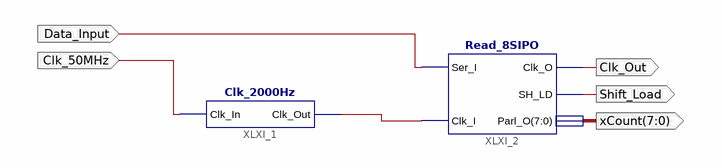
[diagram p0: schematic sheet 1]
// Xilinx ISE schematic FFG.sch (spartan6) as structural Verilog: 2 symbols, 5 ports
module FFG (
  input  Data_Input,
  input  Clk_50MHz,
  output Clk_Out,
  output Shift_Load,
  output [7:0] xCount
);

  wire XLXN_1;

  Clk_2000Hz XLXI_1 (.Clk_In(Clk_50MHz), .Clk_Out(XLXN_1));
  Read_8SIPO XLXI_2 (.Ser_I(Data_Input), .Clk_I(XLXN_1), .Clk_O(Clk_Out), .SH_LD(Shift_Load), .Parl_O(xCount));
endmodule
